# Altium schematic sheet PadaukAudioBoard.SchDoc
size A4; SheetNumber: 1; SheetTotal: 1; SPICEModelCacheNNTYGENI: <root> / <DocumentId>NNTYGENI</DocumentId> / <CacheFrame Number="0"> / <Model Name="865080145010_330uf" Kind="CKT"> / <Text>******* / .subckt 865080145010_330uF 1 2 / Rser 1 3 0.177 / Lser 2 4 5.56044228297646E-09 / C1 3 4 0.00033 / Rpar 3 4 303030.303030303 / .ends 865080145010_330uF</Text> / </Model> / </CacheFrame> / </root>
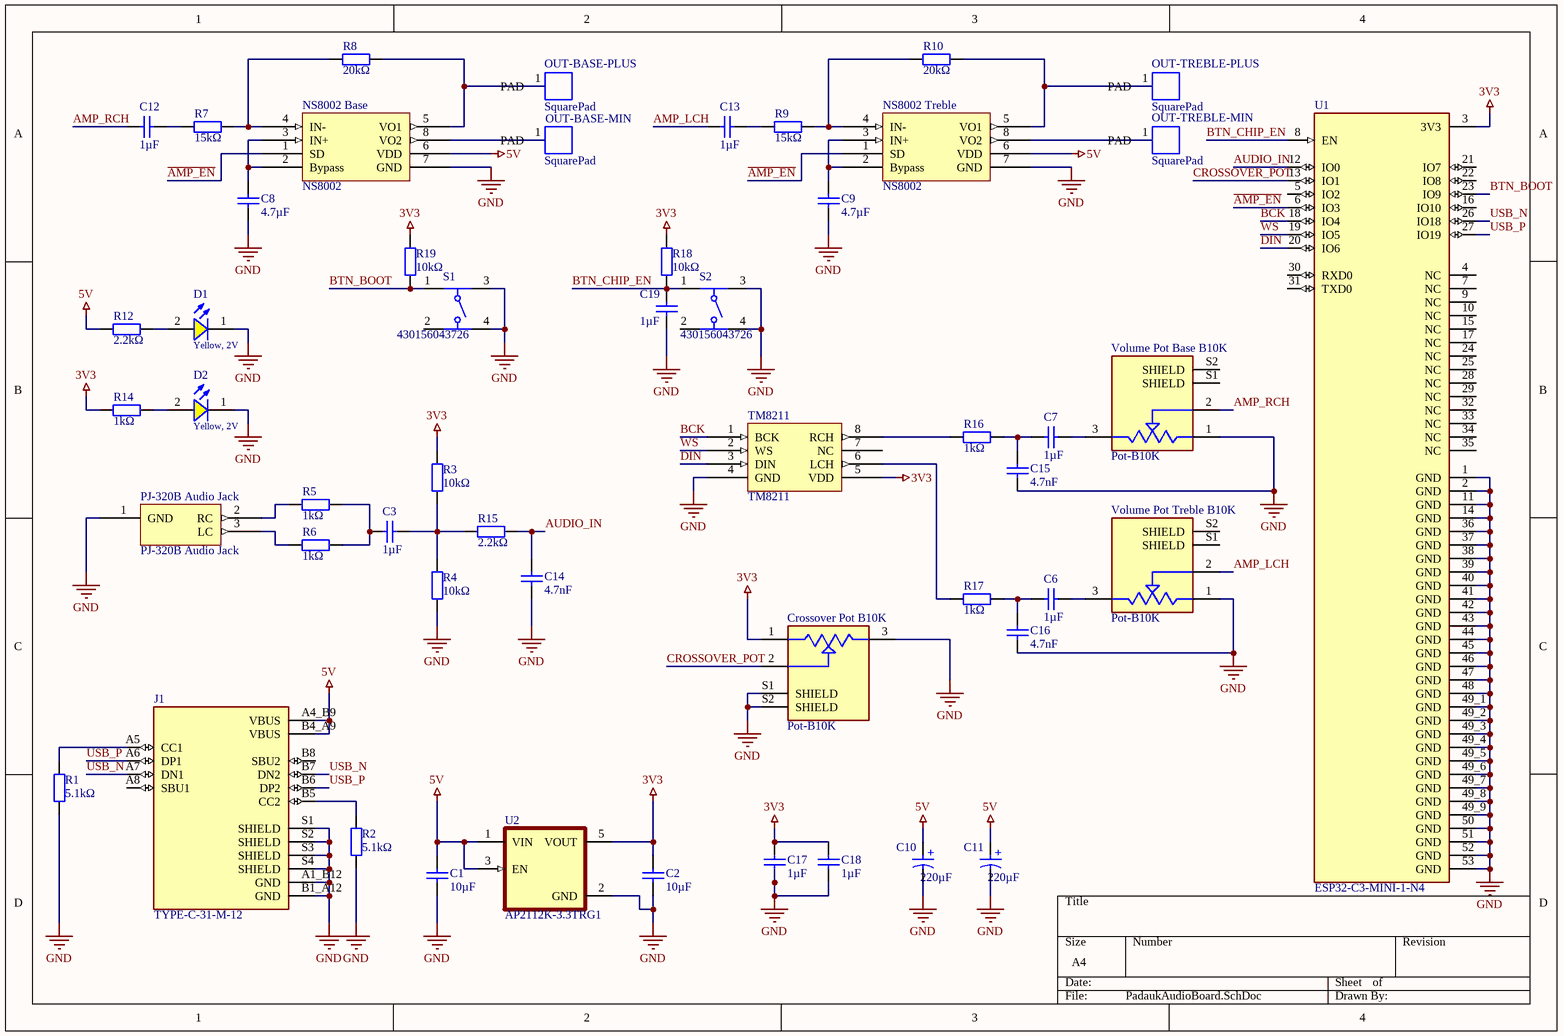
[diagram p0: PadaukAudioBoard.SchDoc]

## Parts
C1  10µF  [WCAP-CSGP_0805_H=0.8mm_Reflow]
C2  10µF  [WCAP-CSGP_0805_H=0.8mm_Reflow]
C3  1µF  [WCAP-CSGP_0805_H=0.8mm_Reflow]
C6  1µF  [WCAP-CSGP_0805_H=0.8mm_Reflow]
C7  1µF  [WCAP-CSGP_0805_H=0.8mm_Reflow]
C8  4.7µF  [WCAP-CSGP_0805_H=0.8mm_Reflow]
C9  4.7µF  [WCAP-CSGP_0805_H=0.8mm_Reflow]
C10  220µF  [WCAP-ASLI_D6.3H7.7]
C11  220µF  [WCAP-ASLI_D6.3H7.7]
C12  1µF  [WCAP-CSGP_0805_H=0.8mm_Reflow]
C13  1µF  [WCAP-CSGP_0805_H=0.8mm_Reflow]
C14  4.7nF  [WCAP-CSGP_0805_H=0.8mm_Reflow]
C15  4.7nF  [WCAP-CSGP_0805_H=0.8mm_Reflow]
C16  4.7nF  [WCAP-CSGP_0805_H=0.8mm_Reflow]
C17  1µF  [WCAP-CSGP_0805_H=0.8mm_Reflow]
C18  1µF  [WCAP-CSGP_0805_H=0.8mm_Reflow]
C19  1µF  [WCAP-CSGP_0805_H=0.8mm_Reflow]
Crossover_Pot_B10K  Pot-B10K  [PTV09A-4025F-B103]
D1  Yellow, 2V  [WL-SMCW_0603_H=0.25mm]
D2  Yellow, 2V  [WL-SMCW_0603_H=0.25mm]
J1  TYPE-C-31-M-12  [HRO_TYPE-C-31-M-12]
NS8002_Base  NS8002  [NS8002]
NS8002_Treble  NS8002  [NS8002]
OUT-BASE-MIN  SquarePad  [Pad3x3mm]
OUT-BASE-PLUS  SquarePad  [Pad3x3mm]
OUT-TREBLE-MIN  SquarePad  [Pad3x3mm]
OUT-TREBLE-PLUS  SquarePad  [Pad3x3mm]
PJ-320B_Audio_Jack  PJ-320B Audio Jack  [PJ-320B Audio Jack]
R1  5.1kΩ  [WRIS-PSMB_0805_H=0.22mm]
R2  5.1kΩ  [WRIS-PSMB_0805_H=0.22mm]
R3  10kΩ  [WRIS-PSMB_0805_H=0.22mm]
R4  10kΩ  [WRIS-PSMB_0805_H=0.22mm]
R5  1kΩ  [WRIS-PSMB_0805_H=0.22mm]
R6  1kΩ  [WRIS-PSMB_0805_H=0.22mm]
R7  15kΩ  [WRIS-PSMB_0805_H=0.22mm]
R8  20kΩ  [WRIS-PSMB_0805_H=0.22mm]
R9  15kΩ  [WRIS-PSMB_0805_H=0.22mm]
R10  20kΩ  [WRIS-PSMB_0805_H=0.22mm]
R12  2.2kΩ  [WRIS-PSMB_0805_H=0.22mm]
R14  1kΩ  [WRIS-PSMB_0805_H=0.22mm]
R15  2.2kΩ  [WRIS-PSMB_0805_H=0.22mm]
R16  1kΩ  [WRIS-PSMB_0805_H=0.22mm]
R17  1kΩ  [WRIS-PSMB_0805_H=0.22mm]
R18  10kΩ  [WRIS-PSMB_0805_H=0.22mm]
R19  10kΩ  [WRIS-PSMB_0805_H=0.22mm]
S1  430156043726  [4301x60437x6]
S2  430156043726  [4301x60437x6]
TM8211  TM8211  [TM8211]
U1  ESP32-C3-MINI-1-N4  [XCVR_ESP32-C3-MINI-1-N4]
U2  AP2112K-3.3TRG1  [SOT95P285X140-5N]
Volume_Pot_Base_B10K  Pot-B10K  [PTV09A-4025F-B103]
Volume_Pot_Treble_B10K  Pot-B10K  [PTV09A-4025F-B103]

## Nets
3V3: C2.2 C17.2 C18.2 Crossover_Pot_B10K.1 R3.2 R14.1 R18.2 R19.2 TM8211.5(VDD) U1.3(3V3) U2.5(VOUT)
5V: C1.2 C10.1(P) C11.1(P) J1.A4_B9(VBUS) J1.B4_A9(VBUS) NS8002_Base.6(VDD) NS8002_Treble.6(VDD) R12.1 U2.1(VIN) U2.3(EN)
GND: C1.1 C2.1 C8.2 C9.2 C10.2(N) C11.2(N) C14.2 C15.2 C16.2 C17.1 C18.1 C19.2 Crossover_Pot_B10K.3 Crossover_Pot_B10K.S1(SHIELD) Crossover_Pot_B10K.S2(SHIELD) D1.1(K) D2.1(K) J1.A1_B12(GND) J1.B1_A12(GND) J1.S1(SHIELD) J1.S2(SHIELD) J1.S3(SHIELD) J1.S4(SHIELD) NS8002_Base.7(GND) NS8002_Treble.7(GND) PJ-320B_Audio_Jack.1(GND) R1.2 R2.1 R4.1 S1.3 S1.4 S2.3 S2.4 TM8211.4(GND) U1.1(GND) U1.2(GND) U1.11(GND) U1.14(GND) U1.36(GND) U1.37(GND) U1.38(GND) U1.39(GND) U1.40(GND) U1.41(GND) U1.42(GND) U1.43(GND) U1.44(GND) U1.45(GND) U1.46(GND) U1.47(GND) U1.48(GND) U1.49_1(GND) U1.49_2(GND) U1.49_3(GND) U1.49_4(GND) U1.49_5(GND) U1.49_6(GND) U1.49_7(GND) U1.49_8(GND) U1.49_9(GND) U1.50(GND) U1.51(GND) U1.52(GND) U1.53(GND) U2.2(GND) Volume_Pot_Base_B10K.1 Volume_Pot_Treble_B10K.1
~{AMP_EN}: NS8002_Base.1(SD) NS8002_Treble.1(SD) U1.6(IO3)
AMP_LCH: C13.1 Volume_Pot_Treble_B10K.2
AMP_RCH: C12.1 Volume_Pot_Base_B10K.2
AUDIO_IN: C14.1 R15.1 U1.12(IO0)
BCK: TM8211.1(BCK) U1.18(IO4)
BTN_BOOT: R19.1 S1.1 U1.23(IO9)
BTN_CHIP_EN: C19.1 R18.1 S2.1 U1.8(EN)
CROSSOVER_POT: Crossover_Pot_B10K.2 U1.13(IO1)
DIN: TM8211.3(DIN) U1.20(IO6)
USB_N: J1.A7(DN1) J1.B7(DN2) U1.26(IO18)
USB_P: J1.A6(DP1) J1.B6(DP2) U1.27(IO19)
WS: TM8211.2(WS) U1.19(IO5)
NetC3_1: C3.1 R3.1 R4.2 R15.2
NetC3_2: C3.2 R5.2 R6.2
NetC6_1: C6.1 Volume_Pot_Treble_B10K.3
NetC6_2: C6.2 C16.1 R17.1
NetC7_1: C7.1 Volume_Pot_Base_B10K.3
NetC7_2: C7.2 C15.1 R16.1
NetC8_1: C8.1 NS8002_Base.2(Bypass) NS8002_Base.3(IN+)
NetC9_1: C9.1 NS8002_Treble.2(Bypass) NS8002_Treble.3(IN+)
NetC12_2: C12.2 R7.1
NetC13_2: C13.2 R9.1
NetD1_2: D1.2(A) R12.2
NetD2_2: D2.2(A) R14.2
NetJ1_A5: J1.A5(CC1) R1.1
NetJ1_B5: J1.B5(CC2) R2.2
NetNS8002_Base_4: NS8002_Base.4(IN-) R7.2 R8.1
NetNS8002_Base_5: NS8002_Base.5(VO1) OUT-BASE-PLUS.1(PAD) R8.2
NetNS8002_Base_8: NS8002_Base.8(VO2) OUT-BASE-MIN.1(PAD)
NetNS8002_Treble_4: NS8002_Treble.4(IN-) R9.2 R10.1
NetNS8002_Treble_5: NS8002_Treble.5(VO1) OUT-TREBLE-PLUS.1(PAD) R10.2
NetNS8002_Treble_8: NS8002_Treble.8(VO2) OUT-TREBLE-MIN.1(PAD)
NetPJ-320B_Audio_Jack_2: PJ-320B_Audio_Jack.2(RC) R5.1
NetPJ-320B_Audio_Jack_3: PJ-320B_Audio_Jack.3(LC) R6.1
NetR16_2: R16.2 TM8211.8(RCH)
NetR17_2: R17.2 TM8211.6(LCH)

Not connected (* = marked no-connect by the designer): J1 A8(SBU1) B8(SBU2); S1 2; S2 2; TM8211 7(NC); U1 4(NC) 5(IO2) 7(NC) 9(NC) 10(NC) 15(NC) 16(IO10) 17(NC) 21(IO7) 22(IO8) 24(NC) 25(NC) 28(NC) 29(NC) 30(RXD0) 31(TXD0) 32(NC) 33(NC) 34(NC) 35(NC); Volume_Pot_Base_B10K S1(SHIELD) S2(SHIELD); Volume_Pot_Treble_B10K S1(SHIELD) S2(SHIELD)

## Notes on the sheet
- (in symbol 865080145010) +

## Library data of the parts
C1-C3 C6-C9 C12-C19 = 885012007021: WCAP-CSGP General Purpose Ceramic Capacitors, size 0805, 1nF, +/-5%, 16VDC; Isolation Resistance: >=10GOhm; Ceramic Type: NP0; Dissipation Factor: Q>=1000; Technical Reference: NP00805102J016DFCT10000; ComponentLink1Description: Manufacturer; ComponentLink1URL: http://www.we-online.de; ComponentLink2Description: Datasheet; ComponentLink2URL: https://katalog.we-online.com/pbs/datasheet/885012007021.pdf; Operating Temperature: -55 to +125degC; Packaging: Tape and Reel; Part Number: 885012007021; Publisher: Wurth Elektronik; Rated Voltage: 16VDC; Published Date: August 2019; Capacitance Tolerance: +/-5%; Height: 0.8mm +/-0.10mm; Mounting Technology: SMD; Size: 0805; Capacitance: 1nF
C10 C11 = 865080145010: WCAP-ASLI Aluminum Electrolytic Capacitor, V-Chip, SMT, 6.3mm x 7.7mm, 330μF, 6.3V; Manufacturer: Wurth Elektronik; Dissipation Factor: 24%; Endurance: 2000h; Impedance: 360mΩ; Leakage Current: 20.79μA; Ripple Current: 275mA; Manufacturer Part Number: 865080145010; Category: Aluminum Electrolytic Capacitors; Match Code: WCAP-ASLI; ComponentLink1Description: Website Link; ComponentLink1URL: https://www.we-online.com/redexpert/article/865080145010?ad; ComponentLink2Description: Datasheet Link; ComponentLink2URL: https://www.we-online.com/redexpert/spec/865080145010?ad; Mount: Surface Mount; Min Operating Temperature: -55°C; Max Operating Temperature: 105°C; Packaging: Tape and Reel; Height: 7.7mm; Diameter: 6.3mm; Capacitance: 330μF; Rated Voltage (DC): 6.3V
Crossover_Pot_B10K Volume_Pot_Base_B10K Volume_Pot_Treble_B10K = RV09AF-40-20K-A10K: PC Mount Black Shaft Potentiometers Audio 9mm 10K; MF: Alpha Taiwan; SnapEDA_Link: https://www.snapeda.com/parts/RV09AF-40-20K-A10K/Alpha/view-part/?ref=snap; Package: None; Value: *; MP: RV09AF-40-20K-A10K; Check_prices: https://www.snapeda.com/parts/RV09AF-40-20K-A10K/Alpha/view-part/?ref=eda
D1 D2 = 150060YS75020: WL-SMCW SMT Mono-color Chip LED Waterclear, size 0603, Yellow, 2V, 140deg; Chip Technology: AlInGaP; Dominant Wavelength typ.: 590nm; Luminous Intensity typ.: 130mcd; Peak Wavelength typ.: 595nm; Viewing Angle: 140deg; ComponentLink1Description: Manufacturer; ComponentLink1URL: http://www.we-online.de; ComponentLink2URL: https://www.we-online.com/catalog/datasheet/150060YS75020.pdf; ComponentLink2Description: Datasheet; Forward Voltage typ.: 2V; Emitting Color: Yellow; Mounting Technology: SMT; Operating Temperature: -40 to +85degC; Published Date: March 2020; Part Number: 150060YS75020; Packaging: Tape and Reel; Size: 0603; Publisher: Wurth Elektronik
J1 = TYPE-C-31-M-12: USB Connectors 24 Receptacle 1 8.94*7.3mm RoHS; MF: HRO Electronics Co., Ltd.; SnapEDA_Link: https://www.snapeda.com/parts/TYPE-C-31-M-12/HRO+Electronics+Co.%252C+Ltd./view-part/?ref=snap; Package: Package; Value: *; MP: TYPE-C-31-M-12; Check_prices: https://www.snapeda.com/parts/TYPE-C-31-M-12/HRO+Electronics+Co.%252C+Ltd./view-part/?ref=eda
R1-R10 R12 R14-R19 = 580060720008: WRIS-PSMB Metal Plate Resistors, size 0805, 10mOhm, +/-1%, 0.5W; Rated Current: 7.07A; Temperature Coefficient of Resistance: +/-100ppm/degC; Technical Reference: MB0805R010F102KAATP0000; ComponentLink1Description: Manufacturer; ComponentLink1URL: http://www.we-online.de; ComponentLink2Description: Datasheet; ComponentLink2URL: https://katalog.we-online.com/pbs/datasheet/580060720008.pdf; Publisher: Wurth Elektronik; Rated Power: 0.5W; Resistance: 10mOhm; Mounting Technology: SMT; Height: 0.22mm; Part Number: 580060720008; Packaging: Tape and Reel; Published Date: September 2019; Size: 0805; Length: 2mm; Operating Temperature: -55 to +155degC; Resistance Tolerance: +/-1%; Width: 1.25mm
S1 S2 = 430156043726: WS-TATV THT Tact Switch 6x6mm, height 4.3mm, 260gf; Rated Voltage: 12VDC; Rated Current: 50mA; Washable: No; ComponentLink1Description: Manufacturer; ComponentLink1URL: http://www.we-online.de; ComponentLink2Description: Datasheet; ComponentLink2URL: https://katalog.we-online.com/em/datasheet/430156043726.pdf; Operating Temperature: -40 to +85degC; Part Number: 430156043726; Published Date: September 2019; Contact Material: Stainless Steel; Height: 4.3mm; Mounting Technology: THT; Contact Plating: Silver; Operation Force: 260gf; Packaging: Bulk; Terminal Material: Copper Alloy; Publisher: Wurth Elektronik; Terminal Plating: Silver
U1 = ESP32-C3-MINI-1-N4: MF: {'manufacturer': u'Espressif Systems'}; Package: None; Price: None; Value: *; MP: ESP32-C3-MINI-1-N4; Availability: Unavailable
U2 = AP2112K-3.3TRG1: Linear Voltage Regulator IC Positive Fixed 1 Output 600mA SOT-25; MF: Diodes Inc.; Value: *; Purchase-URL: https://pricing.snapeda.com/search/part/AP2112K-3.3TRG1/?ref=eda; Package: SOT-753 Diodes Inc.; Availability: In Stock; Check_prices: https://www.snapeda.com/parts/AP2112K-3.3TRG1/Diodes+Inc./view-part/?ref=eda; Price: None; SnapEDA_Link: https://www.snapeda.com/parts/AP2112K-3.3TRG1/Diodes+Inc./view-part/?ref=snap; MP: AP2112K-3.3TRG1